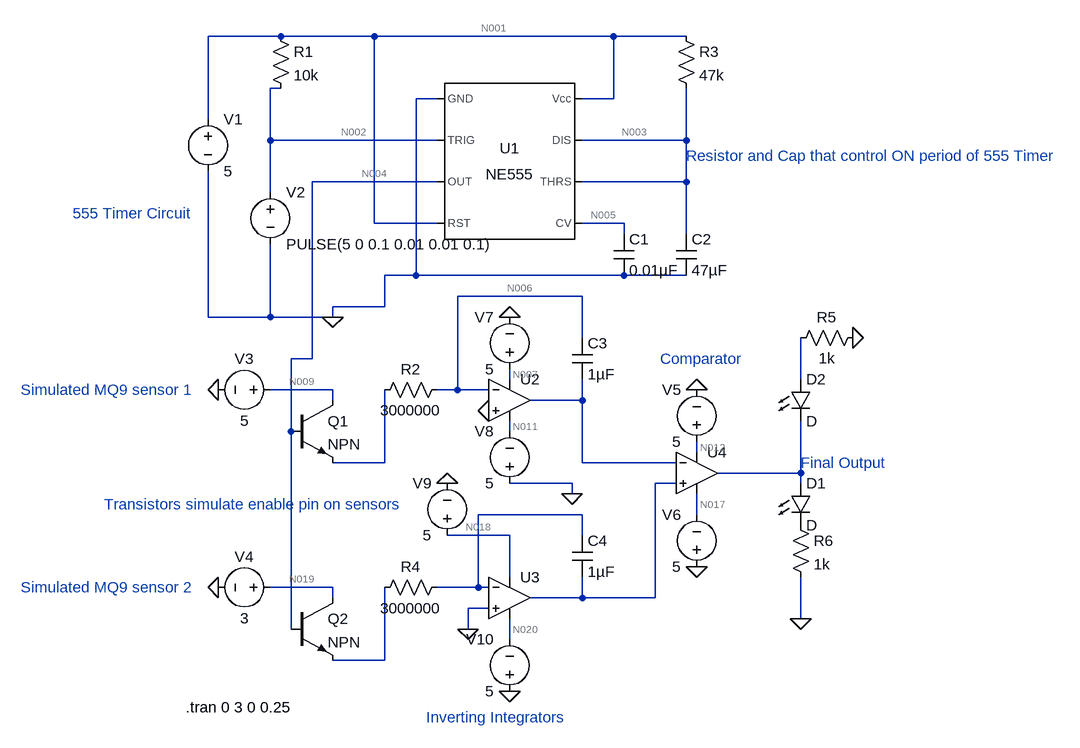
[diagram p0: schematic Draft4.asc]
Draft4.asc, the LTspice schematic file:
Version 4
SHEET 1 1036 968
WIRE -208 -96 -320 -96
WIRE -64 -96 -208 -96
WIRE 304 -96 -64 -96
WIRE 416 -96 304 -96
WIRE -208 -16 -224 -16
WIRE 32 0 0 0
WIRE 304 0 304 -96
WIRE 304 0 256 0
WIRE -320 32 -320 -96
WIRE -224 64 -224 -16
WIRE 32 64 -224 64
WIRE 416 64 416 -16
WIRE 416 64 256 64
WIRE 32 128 -160 128
WIRE 416 128 416 64
WIRE 416 128 256 128
WIRE -224 144 -224 64
WIRE -64 192 -64 -96
WIRE 32 192 -64 192
WIRE 320 192 256 192
WIRE 320 208 320 192
WIRE 416 208 416 128
WIRE 0 272 0 0
WIRE 0 272 -48 272
WIRE 320 272 0 272
WIRE 416 272 320 272
WIRE 256 304 64 304
WIRE -48 320 -48 272
WIRE -48 320 -128 320
WIRE -320 336 -320 112
WIRE -224 336 -224 224
WIRE -224 336 -320 336
WIRE -128 336 -128 320
WIRE -128 336 -224 336
WIRE 256 368 256 304
WIRE -160 400 -160 128
WIRE -160 400 -192 400
WIRE 144 432 144 416
WIRE 592 432 592 368
WIRE -128 448 -224 448
WIRE 64 448 64 304
WIRE 64 448 32 448
WIRE 112 448 64 448
WIRE -128 464 -128 448
WIRE 256 464 256 432
WIRE 256 464 176 464
WIRE -192 512 -192 400
WIRE 144 512 144 496
WIRE 432 544 432 528
WIRE -48 560 -48 448
WIRE -48 560 -128 560
WIRE 256 560 256 464
WIRE 400 560 256 560
WIRE 592 576 592 496
WIRE 592 576 464 576
WIRE 240 592 144 592
WIRE 400 592 368 592
WIRE 592 592 592 576
WIRE 240 608 240 592
WIRE 256 640 96 640
WIRE 432 640 432 608
WIRE 144 672 48 672
WIRE 256 672 256 640
WIRE 144 736 144 672
WIRE -128 752 -224 752
WIRE 96 752 96 640
WIRE 96 752 32 752
WIRE 112 752 96 752
WIRE -128 768 -128 752
WIRE 256 768 256 736
WIRE 256 768 176 768
WIRE 368 768 368 592
WIRE 368 768 256 768
WIRE 112 784 80 784
WIRE 592 800 592 736
WIRE -192 816 -192 512
WIRE 80 816 80 784
WIRE 144 832 144 800
WIRE -48 864 -48 752
WIRE -48 864 -128 864
FLAG -128 336 0
FLAG 80 816 0
FLAG 144 912 0
FLAG 144 336 0
FLAG -304 752 0
FLAG -304 448 0
FLAG 432 720 0
FLAG 432 448 0
FLAG 592 800 0
FLAG 112 480 0
FLAG 240 608 0
FLAG 672 368 0
FLAG 48 592 0
SYMBOL Misc\\NE555 144 96 R0
SYMATTR InstName U1
SYMBOL res -224 -112 R0
SYMATTR InstName R1
SYMATTR Value 10k
SYMBOL cap 304 208 R0
SYMATTR InstName C1
SYMATTR Value 0.01µF
SYMBOL cap 400 208 R0
SYMATTR InstName C2
SYMATTR Value 47µF
SYMBOL res 400 -112 R0
SYMATTR InstName R3
SYMATTR Value 47k
SYMBOL voltage -320 16 R0
WINDOW 123 0 0 Left 0
WINDOW 39 0 0 Left 0
SYMATTR InstName V1
SYMATTR Value 5
SYMBOL voltage -224 128 R0
WINDOW 123 0 0 Left 0
WINDOW 39 0 0 Left 0
SYMATTR InstName V2
SYMATTR Value PULSE(5 0 0.1 0.01 0.01 0.1)
SYMBOL voltage -208 448 R90
WINDOW 0 -32 56 VBottom 2
WINDOW 3 32 56 VTop 2
WINDOW 123 0 0 Left 0
WINDOW 39 0 0 Left 0
SYMATTR InstName V3
SYMATTR Value 5
SYMBOL res -64 464 R270
WINDOW 0 32 56 VTop 2
WINDOW 3 0 56 VBottom 2
SYMATTR InstName R2
SYMATTR Value 3000000
SYMBOL Opamps\\UniversalOpamp2 144 464 R0
SYMATTR InstName U2
SYMBOL cap 240 368 R0
SYMATTR InstName C3
SYMATTR Value 1µF
SYMBOL voltage -208 752 R90
WINDOW 0 -32 56 VBottom 2
WINDOW 3 32 56 VTop 2
WINDOW 123 0 0 Left 0
WINDOW 39 0 0 Left 0
SYMATTR InstName V4
SYMATTR Value 3
SYMBOL res 48 736 R90
WINDOW 0 0 56 VBottom 2
WINDOW 3 32 56 VTop 2
SYMATTR InstName R4
SYMATTR Value 3000000
SYMBOL Opamps\\UniversalOpamp2 144 768 R0
SYMATTR InstName U3
SYMBOL cap 240 672 R0
SYMATTR InstName C4
SYMATTR Value 1µF
SYMBOL Opamps\\UniversalOpamp2 432 576 R0
SYMATTR InstName U4
SYMBOL LED 576 592 R0
SYMATTR InstName D1
SYMBOL LED 576 432 R0
SYMATTR InstName D2
SYMBOL npn -192 464 R0
SYMATTR InstName Q1
SYMBOL npn -192 768 R0
SYMATTR InstName Q2
SYMBOL voltage 432 544 R180
WINDOW 0 24 96 Left 2
WINDOW 3 24 16 Left 2
WINDOW 123 0 0 Left 0
WINDOW 39 0 0 Left 0
SYMATTR InstName V5
SYMATTR Value 5
SYMBOL voltage 432 736 R180
WINDOW 0 24 96 Left 2
WINDOW 3 24 16 Left 2
WINDOW 123 0 0 Left 0
WINDOW 39 0 0 Left 0
SYMATTR InstName V6
SYMATTR Value 5
SYMBOL voltage 144 432 R180
WINDOW 0 24 96 Left 2
WINDOW 3 24 16 Left 2
WINDOW 123 0 0 Left 0
WINDOW 39 0 0 Left 0
SYMATTR InstName V7
SYMATTR Value 5
SYMBOL voltage 144 608 R180
WINDOW 0 24 96 Left 2
WINDOW 3 24 16 Left 2
WINDOW 123 0 0 Left 0
WINDOW 39 0 0 Left 0
SYMATTR InstName V8
SYMATTR Value 5
SYMBOL voltage 144 928 R180
WINDOW 0 24 96 Left 2
WINDOW 3 24 16 Left 2
WINDOW 123 0 0 Left 0
WINDOW 39 0 0 Left 0
SYMATTR InstName V10
SYMATTR Value 5
SYMBOL res 576 640 R0
SYMATTR InstName R6
SYMATTR Value 1k
SYMBOL res 688 352 R90
WINDOW 0 0 56 VBottom 2
WINDOW 3 32 56 VTop 2
SYMATTR InstName R5
SYMATTR Value 1k
SYMBOL voltage 48 688 R180
WINDOW 0 24 96 Left 2
WINDOW 3 24 16 Left 2
WINDOW 123 0 0 Left 0
WINDOW 39 0 0 Left 0
SYMATTR InstName V9
SYMATTR Value 5
TEXT -354 936 Left 2 !.tran 0 3 0 0.25
TEXT 592 560 Left 2 ;Final Output
TEXT 416 88 Left 2 ;Resistor and Cap that control ON period of 555 Timer
TEXT -608 448 Left 2 ;Simulated MQ9 sensor 1
TEXT -608 752 Left 2 ;Simulated MQ9 sensor 2
TEXT -480 624 Left 2 ;Transistors simulate enable pin on sensors
TEXT -528 176 Left 2 ;555 Timer Circuit
TEXT 376 400 Left 2 ;Comparator
TEXT 16 952 Left 2 ;Inverting Integrators

The netlist it stands for:
* Draft4.asc
XU1 0 N002 N004 N001 N005 N003 N003 N001 NE555  ; pins GND TRIG OUT RST CV THRS DIS Vcc
R1 N001 N002 10k
C1 N005 0 0.01µF
C2 N003 0 47µF
R3 N001 N003 47k
V1 N001 0 5
V2 N002 0 PULSE(5 0 0.1 0.01 0.01 0.1)
V3 N009 0 5
R2 N013 N006 3000000
XU2 0 N006 N007 N011 N010 level.2 Avol=1Meg GBW=10Meg Slew=10Meg ilimit=25m rail=0 Vos=0 phimargin=45 en=0 enk=0 in=0 ink=0 Rin=500Meg  ; pins IN+ IN- V+ V- OUT
C3 N006 N010 1µF
V4 N019 0 3
R4 N016 N021 3000000
XU3 0 N016 N018 N020 N015 level.2 Avol=1Meg GBW=10Meg Slew=10Meg ilimit=25m rail=0 Vos=0 phimargin=45 en=0 enk=0 in=0 ink=0 Rin=500Meg  ; pins IN+ IN- V+ V- OUT
C4 N016 N015 1µF
XU4 N015 N010 N012 N017 N014 level.2 Avol=1Meg GBW=10Meg Slew=10Meg ilimit=25m rail=0 Vos=0 phimargin=45 en=0 enk=0 in=0 ink=0 Rin=500Meg  ; pins IN+ IN- V+ V- OUT
D1 N014 P001 D
D2 N008 N014 D
Q1 N009 N004 N013 0 NPN
Q2 N019 N004 N021 0 NPN
V5 N012 0 5
V6 0 N017 5
V7 N007 0 5
V8 0 N011 5
V10 0 N020 5
R6 P001 0 1k
R5 0 N008 1k
V9 N018 0 5
.model D D
.lib standard.dio
.model NPN NPN
.model PNP PNP
.lib standard.bjt
.tran 0 3 0 0.25
* Final Output
* Resistor and Cap that control ON period of 555 Timer
* Simulated MQ9 sensor 1
* Simulated MQ9 sensor 2
* Transistors simulate enable pin on sensors
* 555 Timer Circuit
* Comparator
* Inverting Integrators
.lib NE555.sub
.lib UniversalOpamps2.sub
.backanno
.end

* Results of the author's LTspice run, read from the files saved beside the schematic
* Operating Point, zero values left out:
*   V(n002) = 5 V
*   V(n005) = 3.333 V
*   V(n001) = 5 V
*   V(n003) = 638.2 µV
*   V(n004) = 30 µV
*   V(n009) = 5 V
*   V(n007) = 5 V
*   V(n011) = -5 V
*   V(n019) = 3 V
*   V(n018) = 5 V
*   V(n020) = -5 V
*   V(n012) = 5 V
*   V(n017) = -5 V
*   Ic(Q2) = 3 pA
*   Ib(Q2) = -3 pA
*   Ic(Q1) = 5 pA
*   Ib(Q1) = -5 pA
*   I(R3) = 106.4 µA
*   I(V9) = -500 µA
*   I(V10) = -500 µA
*   I(V8) = -500 µA
*   I(V7) = -500 µA
*   I(V6) = -500 µA
*   I(V5) = -500 µA
*   I(V4) = -3 pA
*   I(V3) = -5 pA
*   I(V2) = -5 nA
*   I(V1) = -1.717 mA
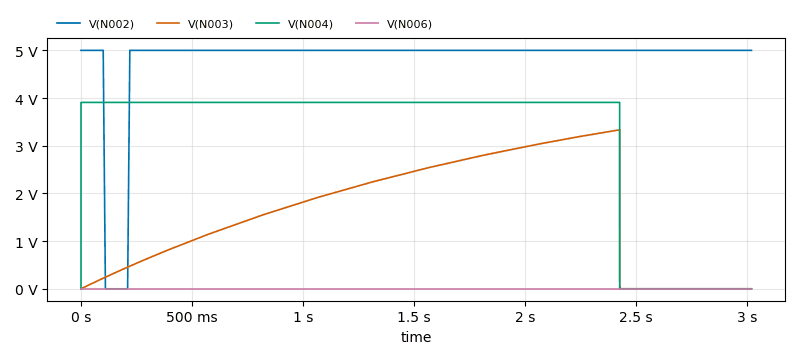
[diagram p1: Transient Analysis of Draft4.asc, plotted from the saved traces]
* Transient Analysis, 1 run:
*   V(N002): min 0 V, max 5 V, average 4.818 V, rms 4.908 V, last 5 V
*   V(N003): min 638.2 µV, max 3.334 V, average 1.579 V, rms 1.96 V, last 638.2 µV
*   V(N004): min 30 µV, max 3.909 V, average 3.14 V, rms 3.503 V, last 30 µV
*   V(N006): min -15.67 µV, max 16.82 µV, average 1.624 µV, rms 1.846 µV, last 2.691 µV